# Altium schematic sheet stepperMotorDriver.SchDoc
size A4; SheetNumber: 1; SheetTotal: 1
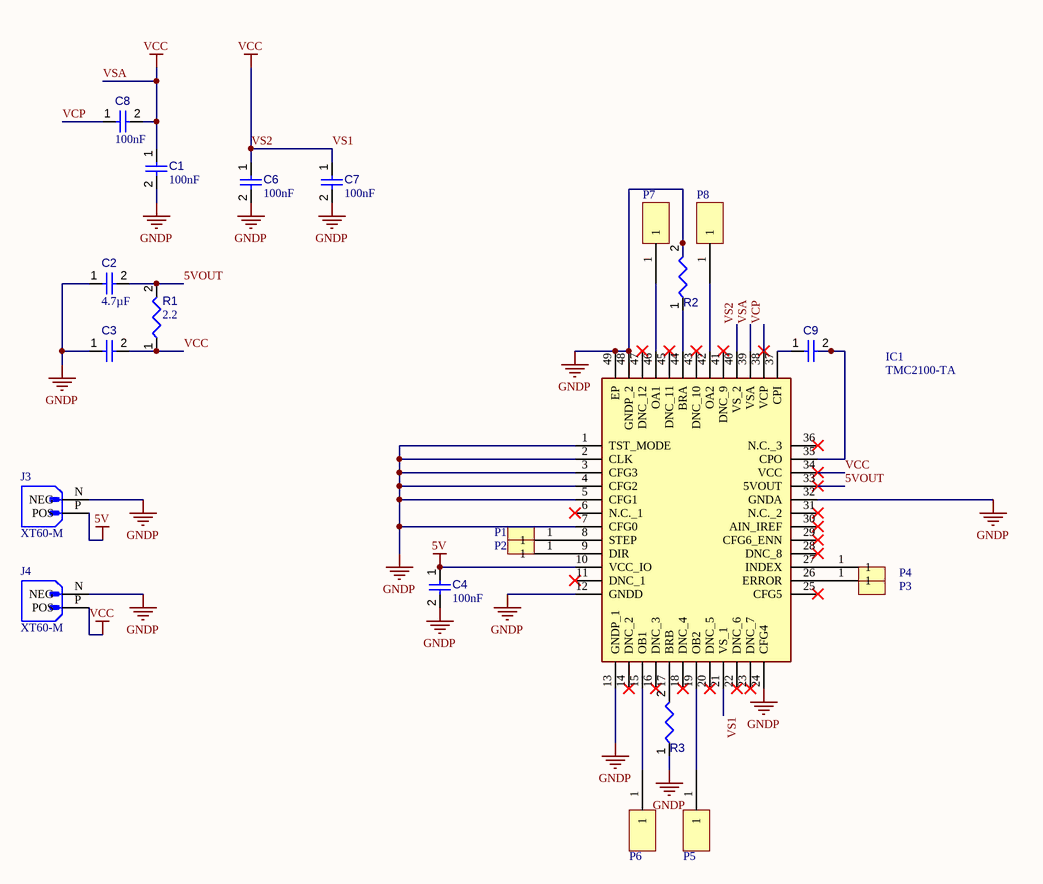
[diagram p0: stepperMotorDriver.SchDoc]

## Parts
C1  value 100nF  [FP-0805-L_2_01_0_2-W_1_25-IPC_B]  (hidden comment: 08055C104J4T2A)
C2  value 4.7µF  [CAPC0805(2012)145_L]  (hidden comment: Capacitor 4.7µF +/-40% 25V 0805)
C3  Capacitor 4.7µF +/-40% 25V 0805  [CAPC0805(2012)145_L]  (value not drawn)
C4  value 100nF  [FP-0805-L_2_01_0_2-W_1_25-IPC_B]  (hidden comment: 08055C104J4T2A)
C6  value 100nF  [FP-0805-L_2_01_0_2-W_1_25-IPC_B]  (hidden comment: 08055C104J4T2A)
C7  value 100nF  [FP-0805-L_2_01_0_2-W_1_25-IPC_B]  (hidden comment: 08055C104J4T2A)
C8  value 100nF  [FP-0805-L_2_01_0_2-W_1_25-IPC_B]  (hidden comment: 08055C104J4T2A)
C9  08055C104J4T2A  [FP-0805-L_2_01_0_2-W_1_25-IPC_B]  (value not drawn)
IC1  TMC2100-TA  [QFP50P900X900X120-49N]
J3  XT60-M  [AMASS_XT60-M]
J4  XT60-M  [AMASS_XT60-M]
P1  P  [Pad 2mm x 5mm-Footprint-1]  (value not drawn)
P2  Pad 2mm5x 5mm  [Pad 2mm x 5mm-Footprint-1]  (value not drawn)
P3  Pad 2mm5x 5mm  [Pad 2mm x 5mm-Footprint-1]  (value not drawn)
P4  Pad 2mm5x 5mm  [Pad 2mm x 5mm-Footprint-1]  (value not drawn)
P5  Pad 3mm5 by 5mm  [Pad 3mm5 by 5mm-Footprint-1]  (value not drawn)
P6  Pad 3mm5 by 5mm  [Pad 3mm5 by 5mm-Footprint-1]  (value not drawn)
P7  Pad 3mm5 by 5mm  [Pad 3mm5 by 5mm-Footprint-1]  (value not drawn)
P8  Pad 3mm5 by 5mm  [Pad 3mm5 by 5mm-Footprint-1]  (value not drawn)
R1  value 2.2  [RESC0402(1005)_L]  (hidden comment: Resistor 2R2  +/-5 % 0402 63 mW)
R2  Resistor 470R +/-5% 0805 125 mW  [RESC0805(2012)_L]  (value not drawn)
R3  Resistor 470R +/-5% 0805 125 mW  [RESC0805(2012)_L]  (value not drawn)

## Nets
5V: C4.1 IC1.10(VCC_IO) J3.P(POS)
GNDP: C1.2 C2.1 C3.1 C4.2 C6.2 C7.2 IC1.1(TST_MODE) IC1.2(CLK) IC1.3(CFG3) IC1.4(CFG2) IC1.5(CFG1) IC1.7(CFG0) IC1.12(GNDD) IC1.13(GNDP_1) IC1.24(CFG4) IC1.32(GNDA) IC1.48(GNDP_2) IC1.49(EP) J3.N(NEG) J4.N(NEG) R2.2 R3.1
VCC: C1.1 C3.2 C6.1 C7.1 C8.2 IC1.21(VS_1) IC1.34(VCC) IC1.39(VSA) IC1.40(VS_2) J4.P(POS) R1.1  [also labelled VS1, VS2, VSA]
5VOUT: C2.2 IC1.33(5VOUT) R1.2
VCP: C8.1 IC1.38(VCP)
NetC9_1: C9.1 IC1.37(CPI)
NetC9_2: C9.2 IC1.35(CPO)
NetIC1_8: IC1.8(STEP) P1.1
NetIC1_9: IC1.9(DIR) P2.1
NetIC1_15: IC1.15(OB1) P6.1
NetIC1_17: IC1.17(BRB) R3.2
NetIC1_19: IC1.19(OB2) P5.1
NetIC1_26: IC1.26(ERROR) P3.1
NetIC1_27: IC1.27(INDEX) P4.1
NetIC1_42: IC1.42(OA2) P8.1
NetIC1_44: IC1.44(BRA) R2.1
NetIC1_46: IC1.46(OA1) P7.1

Not connected (* = marked no-connect by the designer): IC1 6(N.C._1)* 11(DNC_1)* 14(DNC_2)* 16(DNC_3)* 18(DNC_4)* 20(DNC_5)* 22(DNC_6)* 23(DNC_7)* 25(CFG5)* 28(DNC_8)* 29(CFG6_ENN)* 30(AIN_IREF)* 31(N.C._2)* 36(N.C._3)* 41(DNC_9)* 43(DNC_10)* 45(DNC_11)* 47(DNC_12)*

## Library data of the parts
C1 C4 C6-C8 = CMP-001-00088-1: Ceramic Capacitor, Multilayer, Ceramic, 50V, 5% +Tol, 5% -Tol, X7R, 15% TC, 0.1uF, Surface Mount, 0805; Max Operating Temperature: 125°C; Case/Package: 0805; Pins: 2; Mounting Technology: Surface Mount; Min Operating Temperature: -55°C; RoHS Compliant: Yes; Capacitor Type: Ceramic
C2 C3 = CMP-001-00080-4: Chip Capacitor, 4.7µF +/-40%, 25V, 0805, Thickness 1.45 mm; Tolerance: 20%; Voltage Rating: 25V; Min Operating Temperature: -55°C; Max Operating Temperature: 85°C; Pins: 2; Mounting Technology: SMT; Case/Package: 0805
  C3: Value: 4.7µF
C9 = CMP-001-00088-1: Ceramic Capacitor, Multilayer, Ceramic, 50V, 5% +Tol, 5% -Tol, X7R, 15% TC, 0.1uF, Surface Mount, 0805; Value: 100nF; Max Operating Temperature: 125°C; Case/Package: 0805; Pins: 2; Mounting Technology: Surface Mount; Min Operating Temperature: -55°C; RoHS Compliant: Yes; Capacitor Type: Ceramic
IC1 = TMC2100-TA: Integrated Circuit; Manufacturer_Name: Analog Devices; Datasheet Link: https://www.analog.com/media/en/technical-documentation/data-sheets/TMC2100_datasheet_rev1.13.pdf; Height: 1.2mm; Manufacturer_Part_Number: TMC2100-TA; Mouser Part Number: 700-TMC2100TA; Mouser Price/Stock: https://www.mouser.co.uk/ProductDetail/ADI-Trinamic/TMC2100-TA?qs=TiOZkKH1s2TKxin%252BmphkEw%3D%3D
J3 J4 = CMP-130-000000-1: Plug; DC supply; XT60; male; PIN: 2; for cable; soldered; 30A; 500V; MF: AMASS; Pin Count: 2; MP: XT60-M; Design Item ID: XT60-M; Component Type: Standard; Value: *; Source: XT60-M.SchLib; Check_prices: https://www.snapeda.com/parts/XT60-M/AMASS/view-part/?ref=eda; SnapEDA_Link: https://www.snapeda.com/parts/XT60-M/AMASS/view-part/?ref=snap; Package: Package
P1-P4 = CMP-00030-00004-2: a 2.5mm by 5mm copper pad
P5-P8 = CMP-00030-00005-1: a 3.5mm by 5mm pad
R1 = CMP-009-00128-3: Chip Resistor, 2,2 Ohms, +/-5 %, 63 mW, -55 to 155 degC, 0402; Power: 63mW; Tolerance: 5%; Pins: 2; Case/Package: 0402; Min Operating Temperature: -55°C; Max Operating Temperature: 155°C
R2 R3 = CMP-009-00122-3: Chip Resistor, 470 Ohms, +/-5%, 125 mW, -55 to 155 degC, 0805; Tolerance: 5%; Value: 470; Power: 125mW; Max Operating Temperature: 155°C; Case/Package: 0805; Pins: 2; Min Operating Temperature: -55°C